# EAGLE design untitled (EAGLE 9.6.2)
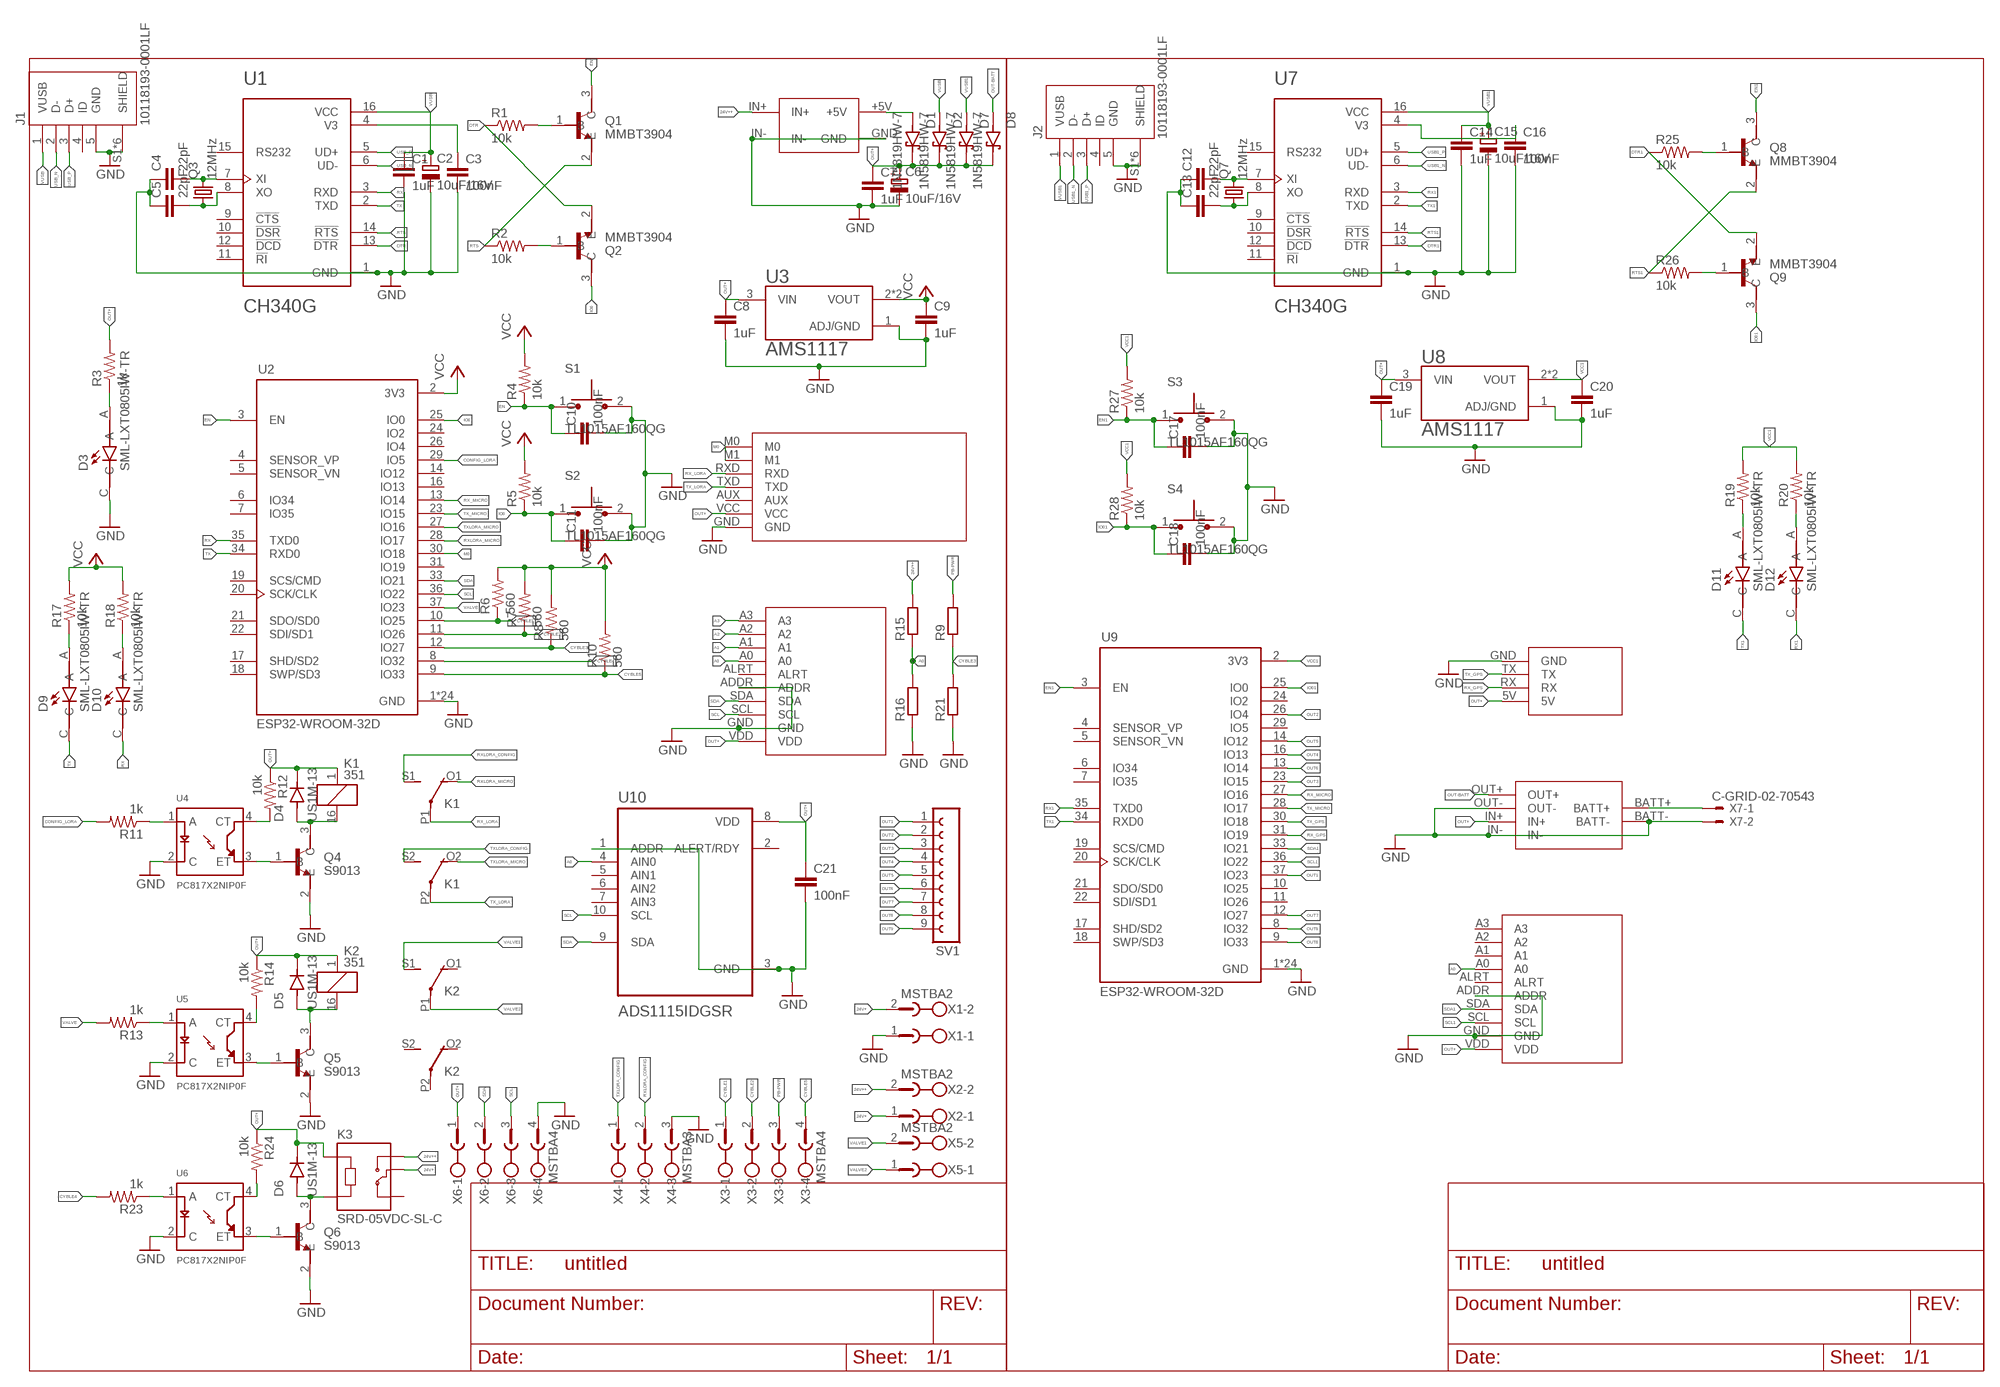
[diagram p0: schematic, sheet 1]

## Parts
ADS1  ADS1115  [ADS1115]
ADS2  ADS1115  [ADS1115]
C1  1uF  C-EUC0805K  [C0805K]
C2  10uF/16V  CPOL-EU153CLV-0505  [153CLV-0505]
C3  100nF  C-EUC0805K  [C0805K]
C4  22pF  C-EUC0805K  [C0805K]
C5  22pF  C-EUC0805K  [C0805K]
C6  10uF/16V  CPOL-EU153CLV-0505  [153CLV-0505]
C7  1uF  C-EUC0805K  [C0805K]
C8  1uF  C-EUC0805K  [C0805K]
C9  1uF  C-EUC0805K  [C0805K]
C10  100nF  C-EUC0805K  [C0805K]
C11  100nF  C-EUC0805K  [C0805K]
C12  22pF  C-EUC0805K  [C0805K]
C13  22pF  C-EUC0805K  [C0805K]
C14  1uF  C-EUC0805K  [C0805K]
C15  10uF/16V  CPOL-EU153CLV-0505  [153CLV-0505]
C16  100nF  C-EUC0805K  [C0805K]
C17  100nF  C-EUC0805K  [C0805K]
C18  100nF  C-EUC0805K  [C0805K]
C19  1uF  C-EUC0805K  [C0805K]
C20  1uF  C-EUC0805K  [C0805K]
C21  100nF  C-EUC0805K  [C0805K]
D1  1N5819HW-7  [SOD3715X145N]
D2  1N5819HW-7  [SOD3715X145N]
D3  SML-LXT0805IW-TR  [LEDC2012X120N]
D4  US1M-13  [DIOM5226X240N]
D5  US1M-13  [DIOM5226X240N]
D6  US1M-13  [DIOM5226X240N]
D7  1N5819HW-7  [SOD3715X145N]
D8  1N5819HW-7  [SOD3715X145N]
D9  SML-LXT0805IW-TR  [LEDC2012X120N]
D10  SML-LXT0805IW-TR  [LEDC2012X120N]
D11  SML-LXT0805IW-TR  [LEDC2012X120N]
D12  SML-LXT0805IW-TR  [LEDC2012X120N]
EBYTEE220-900T22D1  EBYTEE220-900T22D  [EBYTEE220-900T22D]
J1  10118193-0001LF  [FCI_10118193-0001LF]
J2  10118193-0001LF  [FCI_10118193-0001LF]
K1  351  [351]
K2  351  [351]
K3  SRD-05VDC-SL-C  [RELAY_SRD-05VDC-SL-C]
MODUL-BATT1  MODUL-BATT  [MODUL-BATT]
NEO-6MGPS1  NEO-6MGPS  [NEO-6MGPS]
Q1  MMBT3904  [SOT95P240X120-3N]
Q2  MMBT3904  [SOT95P240X120-3N]
Q3  12MHz  CRYSTALSM49  [SM49]
Q4  S9013  [SOT95P240X120-3N]
Q5  S9013  [SOT95P240X120-3N]
Q6  S9013  [SOT95P240X120-3N]
Q7  12MHz  CRYSTALSM49  [SM49]
Q8  MMBT3904  [SOT95P240X120-3N]
Q9  MMBT3904  [SOT95P240X120-3N]
R1  10k  R-US_M0805  [M0805]
R2  10k  R-US_M0805  [M0805]
R3  1k  R-US_M0805  [M0805]
R4  10k  R-US_M0805  [M0805]
R5  10k  R-US_M0805  [M0805]
R6  560  R-US_M0805  [M0805]
R7  560  R-US_M0805  [M0805]
R8  560  R-US_M0805  [M0805]
R9  R-EU_0207/12  [0207/12]
R10  560  R-US_M0805  [M0805]
R11  1k  R-US_M0805  [M0805]
R12  10k  R-US_M0805  [M0805]
R13  1k  R-US_M0805  [M0805]
R14  10k  R-US_M0805  [M0805]
R15  R-EU_0207/12  [0207/12]
R16  R-EU_0207/12  [0207/12]
R17  10k  R-US_M0805  [M0805]
R18  10k  R-US_M0805  [M0805]
R19  10k  R-US_M0805  [M0805]
R20  10k  R-US_M0805  [M0805]
R21  R-EU_0207/12  [0207/12]
R23  1k  R-US_M0805  [M0805]
R24  10k  R-US_M0805  [M0805]
R25  10k  R-US_M0805  [M0805]
R26  10k  R-US_M0805  [M0805]
R27  10k  R-US_M0805  [M0805]
R28  10k  R-US_M0805  [M0805]
S1  TL1015AF160QG  [SW_TL1015AF160QG]
S2  TL1015AF160QG  [SW_TL1015AF160QG]
S3  TL1015AF160QG  [SW_TL1015AF160QG]
S4  TL1015AF160QG  [SW_TL1015AF160QG]
SUPER-STEPDOWN1  SUPER-STEPDOWN  [SUPER-STEPDOWN]
SV1  FE09-1  [FE09]
U1  CH340G  [SOIC127P600X180-16N]
U2  ESP32-WROOM-32D  [MODULE_ESP32-WROOM-32D]
U3  AMS1117  [SOT229P700X180-4N]
U4  PC817X2NIP0F  [SOT254P975X400-4N]
U5  PC817X2NIP0F  [SOT254P975X400-4N]
U6  PC817X2NIP0F  [SOT254P975X400-4N]
U7  CH340G  [SOIC127P600X180-16N]
U8  AMS1117  [SOT229P700X180-4N]
U9  ESP32-WROOM-32D  [MODULE_ESP32-WROOM-32D]
U10  ADS1115IDGSR  [SOP50P490X110-10N]
X1  MSTBA2  [MSTBA2]
X2  MSTBA2  [MSTBA2]
X3  MSTBA4  [MSTBA4]
X4  MSTBA3  [MSTBA3]
X5  MSTBA2  [MSTBA2]
X6  MSTBA4  [MSTBA4]
X7  C-GRID-02-70543  [70543-02]

## Nets
24V+: K3.COM X1.2 X2.1
24V++: K3.NO R15.2 SUPER-STEPDOWN1.IN+ X2.2
A0: ADS1.A0 ADS2.A0 R15.1 R16.2 U10.4(AIN0)
A1: ADS1.A1
A2: ADS1.A2
A3: ADS1.A3
CONFIG_LORA: R11.2 U2.29(IO5)
CYBLE1: R6.1 U2.10(IO25) X3.1
CYBLE2: R7.1 U2.11(IO26) X3.2
CYBLE3: R8.1 R9.1 R21.2 U2.12(IO27)
CYBLE4: R23.2 U2.8(IO32)
CYBLE5: R10.1 U2.9(IO33) X3.4
DTR: Q2.2(E) R1.1 U1.13(!DTR)
DTR1: Q9.2(E) R25.1 U7.13(!DTR)
EN: C10.1 Q1.3(C) R4.1 S1.1 U2.3(EN)
EN1: C17.1 Q8.3(C) R27.1 S3.1 U9.3(EN)
GND: ADS1.ADDR ADS1.GND ADS2.ADDR ADS2.GND C1.2 C2.- C3.2 C4.1 C5.1 C6.- C7.2 C8.2 C9.2 C10.2 C11.2 C12.1 C13.1 C14.2 C15.- C16.2 C17.2 C18.2 C19.2 C20.2 C21.2 D3.C EBYTEE220-900T22D1.GND J1.5(GND) J1.S1(SHIELD) J1.S2(SHIELD) J1.S3(SHIELD) J1.S4(SHIELD) J1.S5(SHIELD) J1.S6(SHIELD) J2.5(GND) J2.S1(SHIELD) J2.S2(SHIELD) J2.S3(SHIELD) J2.S4(SHIELD) J2.S5(SHIELD) J2.S6(SHIELD) MODUL-BATT1.BATT- MODUL-BATT1.IN- MODUL-BATT1.OUT- NEO-6MGPS1.GND Q4.2(E) Q5.2(E) Q6.2(E) R16.1 R21.1 S1.2 S2.2 S3.2 S4.2 SUPER-STEPDOWN1.GND SUPER-STEPDOWN1.IN- U1.1(GND) U2.1(GND) U2.15(GND) U2.38(GND) U2.39_1(GND) U2.39_2(GND) U2.39_3(GND) U2.39_4(GND) U2.39_5(GND) U2.39_6(GND) U2.39_7(GND) U2.39_8(GND) U2.39_9(GND) U2.39_10(GND) U2.39_11(GND) U2.39_12(GND) U2.39_13(GND) U2.39_14(GND) U2.39_15(GND) U2.39_16(GND) U2.39_17(GND) U2.39_18(GND) U2.39_19(GND) U2.39_20(GND) U2.39_21(GND) U3.1(ADJ/GND) U4.2(C) U5.2(C) U6.2(C) U7.1(GND) U8.1(ADJ/GND) U9.1(GND) U9.15(GND) U9.38(GND) U9.39_1(GND) U9.39_2(GND) U9.39_3(GND) U9.39_4(GND) U9.39_5(GND) U9.39_6(GND) U9.39_7(GND) U9.39_8(GND) U9.39_9(GND) U9.39_10(GND) U9.39_11(GND) U9.39_12(GND) U9.39_13(GND) U9.39_14(GND) U9.39_15(GND) U9.39_16(GND) U9.39_17(GND) U9.39_18(GND) U9.39_19(GND) U9.39_20(GND) U9.39_21(GND) U10.1(ADDR) U10.3(GND) X1.1 X4.3 X6.4 X7.2
IO0: C11.1 Q2.3(C) R5.1 S2.1 U2.25(IO0)
IO01: C18.1 Q9.3(C) R28.1 S4.1 U9.25(IO0)
M0: EBYTEE220-900T22D1.M0 EBYTEE220-900T22D1.M1 U2.30(IO18)
N$1: C4.2 Q3.2 U1.7(XI)
N$2: C5.2 Q3.1 U1.8(XO)
N$3: Q1.1(B) R1.2
N$4: Q8.1(B) R25.2
N$5: C3.1 U1.4(V3)
N$6: D3.A R3.1
N$7: D1.A SUPER-STEPDOWN1.+5V
N$8: Q2.1(B) R2.2
N$9: R11.1 U4.1(A)
N$10: R12.2 U4.4(CT)
N$11: R13.1 U5.1(A)
N$12: D4.A K1.16 Q4.3(C)
N$13: Q4.1(B) U4.3(ET)
N$14: R14.2 U5.4(CT)
N$15: D5.A K2.16 Q5.3(C)
N$16: Q9.1(B) R26.2
N$17: Q5.1(B) U5.3(ET)
N$18: D9.A R17.1
N$19: R24.2 U6.4(CT)
N$20: D6.A K3.A2 Q6.3(C)
N$21: D10.A R18.1
N$22: D11.A R19.1
N$23: D12.A R20.1
N$24: Q6.1(B) U6.3(ET)
N$25: R23.1 U6.1(A)
N$26: C16.1 U7.4(V3)
N$27: C13.2 Q7.1 U7.8(XO)
N$28: C12.2 Q7.2 U7.7(XI)
N$29: MODUL-BATT1.BATT+ X7.1
OUT1: SV1.1 U9.37(IO23)
OUT2: SV1.2 U9.26(IO4)
OUT3: SV1.3 U9.23(IO15)
OUT4: SV1.4 U9.16(IO13)
OUT5: SV1.5 U9.14(IO12)
OUT6: SV1.6 U9.13(IO14)
OUT7: SV1.7 U9.12(IO27)
OUT8: SV1.8 U9.9(IO33)
OUT9: SV1.9 U9.8(IO32)
OUT+: ADS1.VDD ADS2.VDD C6.+ C7.1 C8.1 C19.1 C21.1 D1.C(K) D2.C(K) D4.C(K) D5.C(K) D6.C(K) D7.C(K) D8.C(K) EBYTEE220-900T22D1.VCC K1.1 K2.1 K3.A1 MODUL-BATT1.IN+ NEO-6MGPS1.5V R3.2 R12.1 R14.1 R24.1 U3.3(VIN) U8.3(VIN) U10.8(VDD) X6.1
OUT-BATT: D8.A MODUL-BATT1.OUT+
PB-PWR: R9.2 X3.3
RTS: Q1.2(E) R2.1 U1.14(!RTS)
RTS1: Q8.2(E) R26.1 U7.14(!RTS)
RX: D10.C U1.3(RXD) U2.35(TXD0)
RX1: D12.C U7.3(RXD) U9.35(TXD0)
RX_GPS: NEO-6MGPS1.RX U9.31(IO19)
RX_LORA: EBYTEE220-900T22D1.RXD K1.P1(2:P)
RX_MICRO: U2.13(IO14) U9.27(IO16)
RXLORA_CONFIG: K1.S1(2:S) X4.2
RXLORA_MICRO: K1.O1(2:O) U2.28(IO17)
SCL: ADS1.SCL U2.36(IO22) U10.10(SCL) X6.3
SCL1: ADS2.SCL U9.36(IO22)
SDA: ADS1.SDA U2.33(IO21) U10.9(SDA) X6.2
SDA1: ADS2.SDA U9.33(IO21)
TX: D9.C U1.2(TXD) U2.34(RXD0)
TX1: D11.C U7.2(TXD) U9.34(RXD0)
TX_GPS: NEO-6MGPS1.TX U9.30(IO18)
TX_LORA: EBYTEE220-900T22D1.TXD K1.P2(3:P)
TX_MICRO: U2.23(IO15) U9.28(IO17)
TXLORA_CONFIG: K1.S2(3:S) X4.1
TXLORA_MICRO: K1.O2(3:O) U2.27(IO16)
USB1_N: J2.2(D-) U7.6(UD-)
USB1_P: J2.3(D+) U7.5(UD+)
USB_N: J1.2(D-) U1.6(UD-)
USB_P: J1.3(D+) U1.5(UD+)
VALVE: R13.2 U2.37(IO23)
VALVE1: K2.S1(2:S) X5.2
VALVE2: K2.P1(2:P) X5.1
VCC: C9.1 R4.2 R5.2 R6.2 R7.2 R8.2 R10.2 R17.2 R18.2 U2.2(3V3) U3.2(VOUT) U3.4(VOUT)
VCC1: C20.1 R19.2 R20.2 R27.2 R28.2 U8.2(VOUT) U8.4(VOUT) U9.2(3V3)
VUSB: C1.1 C2.+ D2.A J1.1(VUSB) U1.16(VCC)
VUSB1: C14.1 C15.+ D7.A J2.1(VUSB) U7.16(VCC)
Unconnected: ADS1.ALRT ADS2.A1 ADS2.A2 ADS2.A3 ADS2.ALRT EBYTEE220-900T22D1.AUX J1.4(ID) J2.4(ID) K2.O1(2:O) K2.O2(3:O) K2.P2(3:P) K2.S2(3:S) K3.NC U1.9(!CTS) U1.10(!DSR) U1.11(!RI) U1.12(!DCD) U1.15(RS232) U2.4(SENSOR_VP) U2.5(SENSOR_VN) U2.6(IO34) U2.7(IO35) U2.14(IO12) U2.16(IO13) U2.17(SHD/SD2) U2.18(SWP/SD3) U2.19(SCS/CMD) U2.20(SCK/CLK) U2.21(SDO/SD0) U2.22(SDI/SD1) U2.24(IO2) U2.26(IO4) U2.31(IO19) U7.9(!CTS) U7.10(!DSR) U7.11(!RI) U7.12(!DCD) U7.15(RS232) U9.4(SENSOR_VP) U9.5(SENSOR_VN) U9.6(IO34) U9.7(IO35) U9.10(IO25) U9.11(IO26) U9.17(SHD/SD2) U9.18(SWP/SD3) U9.19(SCS/CMD) U9.20(SCK/CLK) U9.21(SDO/SD0) U9.22(SDI/SD1) U9.24(IO2) U9.29(IO5) U10.2(ALERT/RDY) U10.5(AIN1) U10.6(AIN2) U10.7(AIN3)

## Library data of the parts
ADS1 ADS2 = ds1115:ADS1115
C1 C3-C5 C7-C14 C16-C21 = rcl:C-EU: CAPACITOR, European symbol; SPICEPREFIX: C
C2 C6 C15 = rcl:CPOL-EU: POLARIZED CAPACITOR, European symbol; SPICEPREFIX: C
D1 D2 D7 D8 = 1N5819HW-7:1N5819HW-7: 1N5819HW Series 40 V 1 A Surface Mount Schottky Barrier Rectifier - SOD-123 Check availability <https://pricing.snapeda.com/parts/1N5819HW-7/Diodes%20Inc./view-part?ref=eda>; AVAILABILITY: In Stock; DESCRIPTION: Diode Schottky 40 V 1A Surface Mount SOD-123; MF: Diodes Inc.; MP: 1N5819HW-7; PACKAGE: SOD-123 Fairchild Semiconductor; PRICE: None; PURCHASE-URL: https://pricing.snapeda.com/search/part/1N5819HW-7/?ref=eda
D3 D9-D12 = SML-LXT0805IW-TR:SML-LXT0805IW-TR: LED; Luminous Intensity:11µcd; Viewing Angle:140°; Forward Current:30mA; Forward Voltage:2V; Color:Red; LED Color:Red; Leaded Process Compatible:Yes; Lens Color:White; Mounting Type:Surface Mount ;RoHS Compliant: Yes Check availability <https://pricing.snapeda.com/parts/SML-LXT0805IW-TR/Lumex%20Opto/Components/view-part?ref=eda>; AVAILABILITY: In Stock; DESCRIPTION: Red - LED Indication - Discrete 2V 0805 (2012 Metric); MF: Lumex Opto/Components; MP: SML-LXT0805IW-TR; PACKAGE: 0805 Lumex; PRICE: None; PURCHASE-URL: https://pricing.snapeda.com/search/part/SML-LXT0805IW-TR/?ref=eda
D4-D6 = US1M-13:US1M-13: Diode, Fast Recovery, 1a, 1kv, Do-214ac-2, Full Reel Check availability <https://pricing.snapeda.com/parts/US1M-13/Diodes%20Incorporated/view-part?ref=eda>; AVAILABILITY: In Stock; DESCRIPTION: Diode Standard 1000 V 1A Surface Mount SMA; MF: Diodes Incorporated; MP: US1M-13; PACKAGE: DO-214AC-214 Diodes Incorporated; PRICE: None; PURCHASE-URL: https://pricing.snapeda.com/search/part/US1M-13/?ref=eda
EBYTEE220-900T22D1 = EByte E220-900T22D:EBYTEE220-900T22D
J1 J2 = 10118193-0001LF:10118193-0001LF: Micro USB B Type Receptacle Check availability <https://pricing.snapeda.com/parts/10118193-0001LF/FCI/view-part?ref=eda>; AVAILABILITY: In Stock; DESCRIPTION: USB - micro B USB 2.0 Receptacle Connector 5 Position Surface Mount, Right Angle; Through Hole; MF: FCI; MP: 10118193-0001LF; PACKAGE: None; PRICE: None; PURCHASE-URL: https://pricing.snapeda.com/search/part/10118193-0001LF/?ref=eda
K1 K2 = relay:351: RELAY 2 x switch, Omron; OC_FARNELL: unknown; OC_NEWARK: unknown
K3 = SRD-05VDC-SL-C:SRD-05VDC-SL-C: 5V Trigger Relay Module For Arduino And Raspberry Pi 5V Trigger Relay Module For Arduino And Raspberry Pi Check availability <https://pricing.snapeda.com/parts/SRD-05VDC-SL-C/Songle%20Relay/view-part?ref=eda>; AVAILABILITY: Not in stock; DESCRIPTION: 5V Trigger Relay Module For Arduino And Raspberry Pi 5V Trigger Relay Module For Arduino And Raspberry Pi; MF: Songle Relay; MP: SRD-05VDC-SL-C; PACKAGE: NON STANDARD-5 Songle Relay; PRICE: None
MODUL-BATT1 = MODUL-BATT:MODUL-BATT
NEO-6MGPS1 = NEO-6M GPS:NEO-6MGPS
Q1 Q2 Q8 Q9 = MMBT3904:MMBT3904: MMBT3904 Series 40 V CE Breakdown 0.2 A NPN General Purpose Amplifier - SOT-23 Check availability <https://pricing.snapeda.com/parts/MMBT3904/ON%20Semiconductor/view-part?ref=eda>; AVAILABILITY: In Stock; DESCRIPTION: Bipolar (BJT) Transistor NPN 40 V 200 mA 300MHz 300 mW Surface Mount SOT-23-3 (TO-236); MF: ON Semiconductor; MP: MMBT3904; PACKAGE: SOT-23-3 Motorola; PRICE: None
Q3 Q7 = crystal:CRYSTAL: CRYSTAL; OC_FARNELL: unknown; OC_NEWARK: unknown
Q4-Q6 = S9013:S9013: SMD Transistors NPN 25V-500mA Check availability <https://pricing.snapeda.com/parts/S9013/JCET/view-part?ref=eda>; AVAILABILITY: In Stock; DESCRIPTION: Bipolar (BJT) Transistor NPN 20V 500mA 625mW Through Hole TO-92-3; MF: JCET; MP: S9013; PACKAGE: SOT-23-3 JCET; PRICE: None; PURCHASE-URL: https://pricing.snapeda.com/search/part/S9013/?ref=eda
R1-R8 R10-R14 R17-R20 R23-R28 = rcl:R-US_: RESISTOR, American symbol; SPICEPREFIX: R
R9 R15 R16 R21 = rcl:R-EU_: RESISTOR, European symbol; SPICEPREFIX: R
S1-S4 = TL1015AF160QG:TL1015AF160QG: Tactile Switch SPST-NO Top Actuated Surface Mount Check availability <https://pricing.snapeda.com/parts/TL1015AF160QG/E-Switch/view-part?ref=eda>; AVAILABILITY: In Stock; DESCRIPTION: Tactile Switch SPST-NO Top Actuated Surface Mount; MF: E-Switch; MP: TL1015AF160QG; PACKAGE: None; PRICE: None; PURCHASE-URL: https://pricing.snapeda.com/search/part/TL1015AF160QG/?ref=eda
SUPER-STEPDOWN1 = SUPER-STEPDOWN:SUPER-STEPDOWN
SV1 = con-lsta:FE09-1: FEMALE HEADER; OC_FARNELL: unknown; OC_NEWARK: unknown
U1 U7 = CH340G:CH340G: Check availability <https://pricing.snapeda.com/parts/Ch340G/WCH/view-part?ref=eda>; AVAILABILITY: Not in stock; DESCRIPTION: USB Interface Integrated Circuit; MF: WCH; MP: Ch340G; PACKAGE: None; PRICE: None
U2 U9 = ESP32-WROOM-32D:ESP32-WROOM-32D: Bluetooth, WiFi 802.11b/g/n, Bluetooth v4.2 + EDR, Class 1, 2 and 3 Transceiver Module 2.4GHz ~ 2.5GHz Integrated, Trace Surface Mount Check availability <https://pricing.snapeda.com/parts/ESP32-WROOM-32D/Espressif%20Systems/view-part?ref=eda>; AVAILABILITY: In Stock; DESCRIPTION: Bluetooth, WiFi 802.11b/g/n, Bluetooth v4.2 +EDR, Class 1, 2 and 3 Transceiver Module 2.4GHz ~ 2.5GHz Integrated; MF: Espressif Systems; MP: ESP32-WROOM-32D; PACKAGE: Module Espressif Systems; PRICE: None; PURCHASE-URL: https://pricing.snapeda.com/search/part/ESP32-WROOM-32D/?ref=eda
U3 U8 = AMS1117:AMS1117: Sot223/Pkg 1-Amp 5-Volt Low Drop Out Voltage Regulatator Check availability <https://pricing.snapeda.com/parts/AMS1117/Advanced%20Monolithic%20Systems/view-part?ref=eda>; AVAILABILITY: Not in stock; DESCRIPTION: 1A LOW DROPOUT VOLTAGE REGULATOR SOT-223; MF: Advanced Monolithic Systems; MP: AMS1117; PACKAGE: SOT-223 Seeed Technology; PRICE: None
U4-U6 = PC817X2NIP0F:PC817X2NIP0F: PC817 Series 1 Channel 80 V 5000 Vrms General Purpose Photocoupler - DIP-4 Check availability <https://pricing.snapeda.com/parts/PC817X2NIP0F/Sharp%20Microelectronics/view-part?ref=eda>; AVAILABILITY: Not in stock; DESCRIPTION: Optoisolator Transistor Output 5000Vrms 1 Channel 4-SMD; MF: Sharp Microelectronics; MP: PC817X2NIP0F; PACKAGE: SMD-4 Sharp Microelectronics; PRICE: None
U10 = ADS1115IDGSR:ADS1115IDGSR: Check availability <https://pricing.snapeda.com/parts/ADS1115IDGSR/Texas%20Instruments/view-part?ref=eda>; AVAILABILITY: In Stock; DESCRIPTION: 16-bit, 860-SPS, 4-channel, delta-sigma ADC with PGA, oscillator, VREF, comparator and I2C; MF: Texas Instruments; MP: ADS1115IDGSR; PACKAGE: VSSOP-10 Texas Instruments; PRICE: None; PURCHASE-URL: https://pricing.snapeda.com/search/part/ADS1115IDGSR/?ref=eda
X1 X2 X5 = con-phoenix-508:MSTBA2: PHOENIX; MF: FARNELL; MPN: 1757242; OC_FARNELL: 3705171; OC_NEWARK: 71C4161
X3 X6 = con-phoenix-508:MSTBA4: PHOENIX; MF: FARNELL; MPN: 1757268; OC_FARNELL: 3705195; OC_NEWARK: 71C4163
X4 = con-phoenix-508:MSTBA3: PHOENIX; MF: FARNELL; MPN: 1757255; OC_FARNELL: 3705183; OC_NEWARK: 71C4162
X7 = con-molex:C-GRID-02: CONNECTOR wire to board 2.54 mm (0.100") pitch header; MF: MOLEX; OC_FARNELL: unknown; OC_NEWARK: unknown

## Board
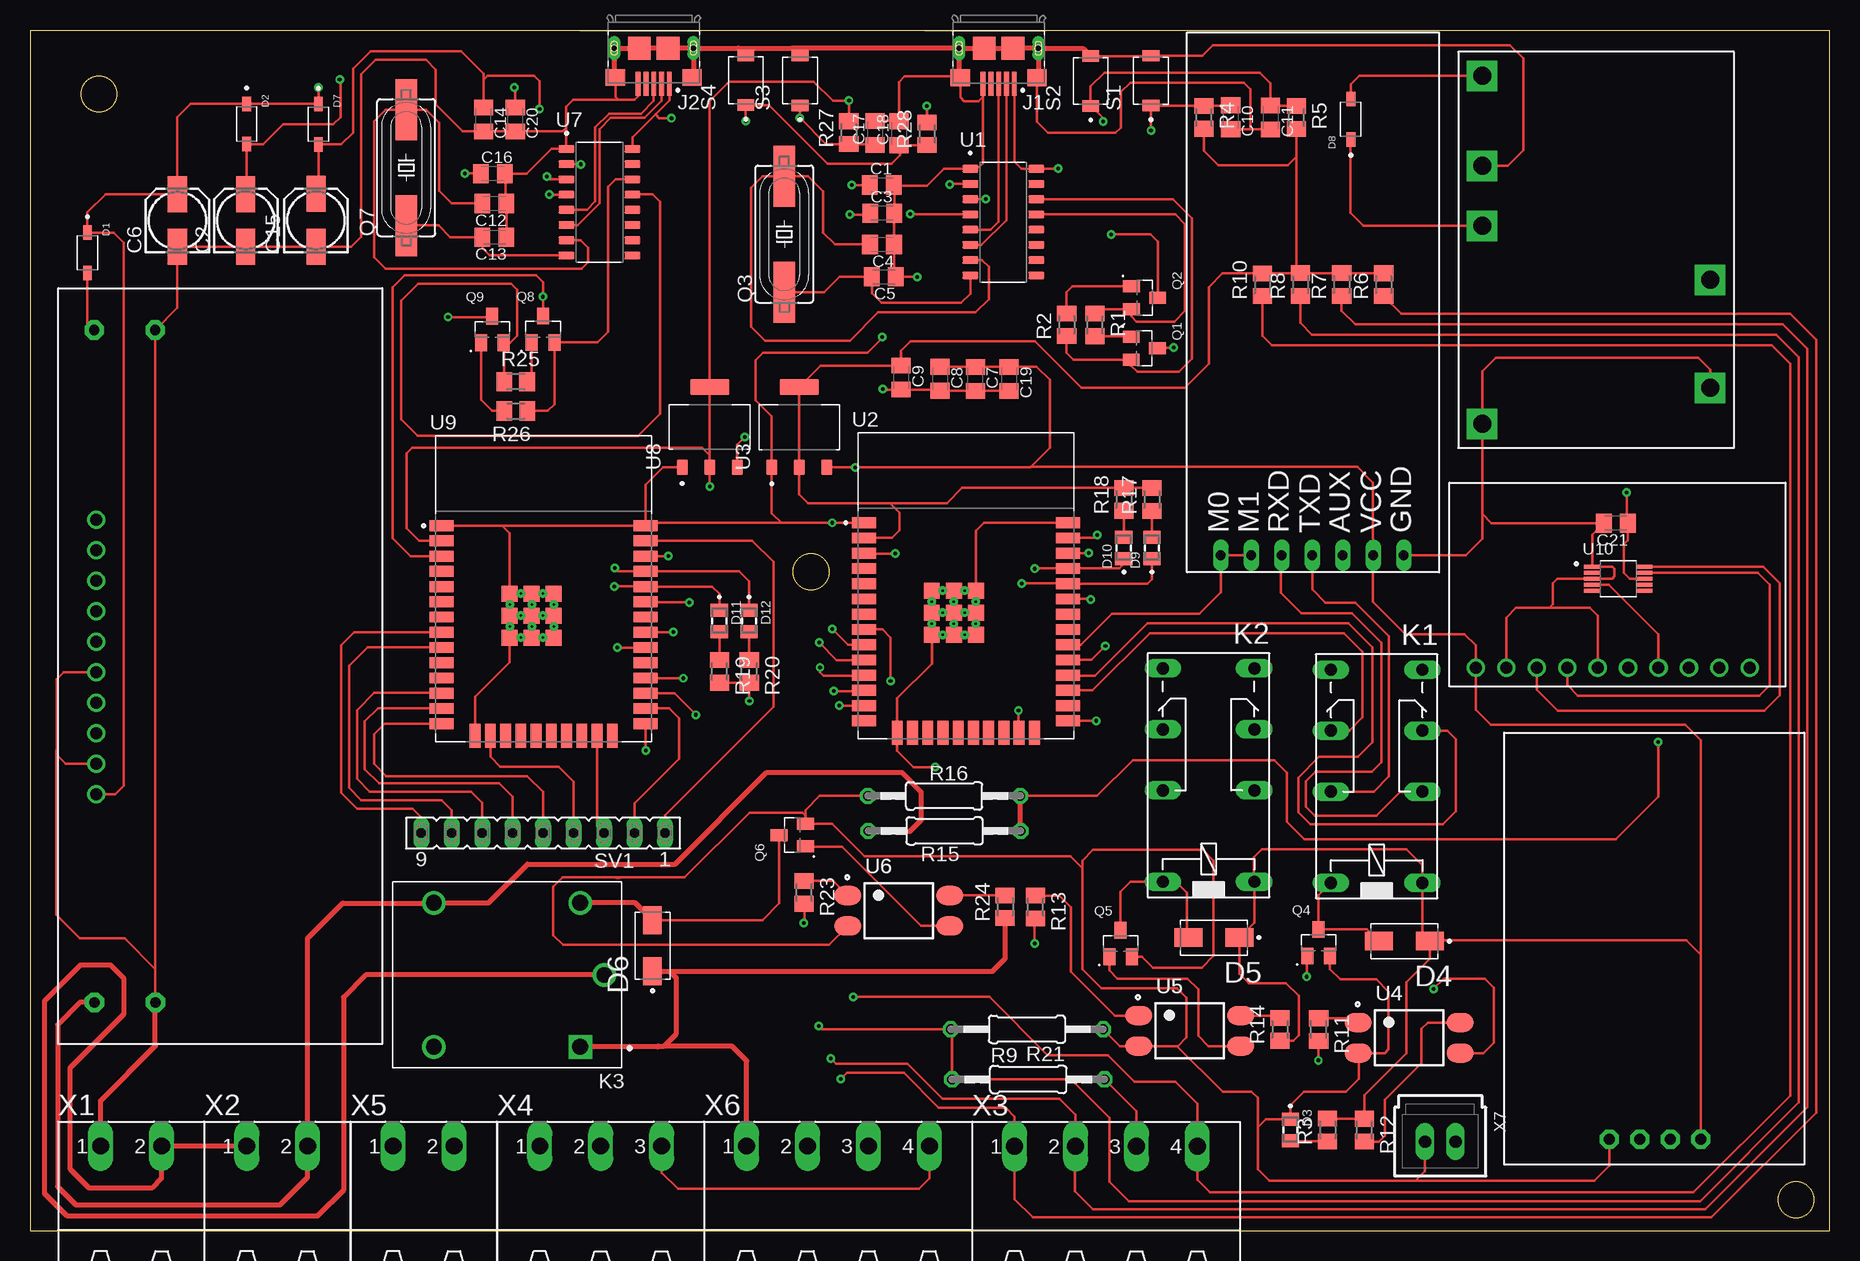
[diagram p1: board, top side]
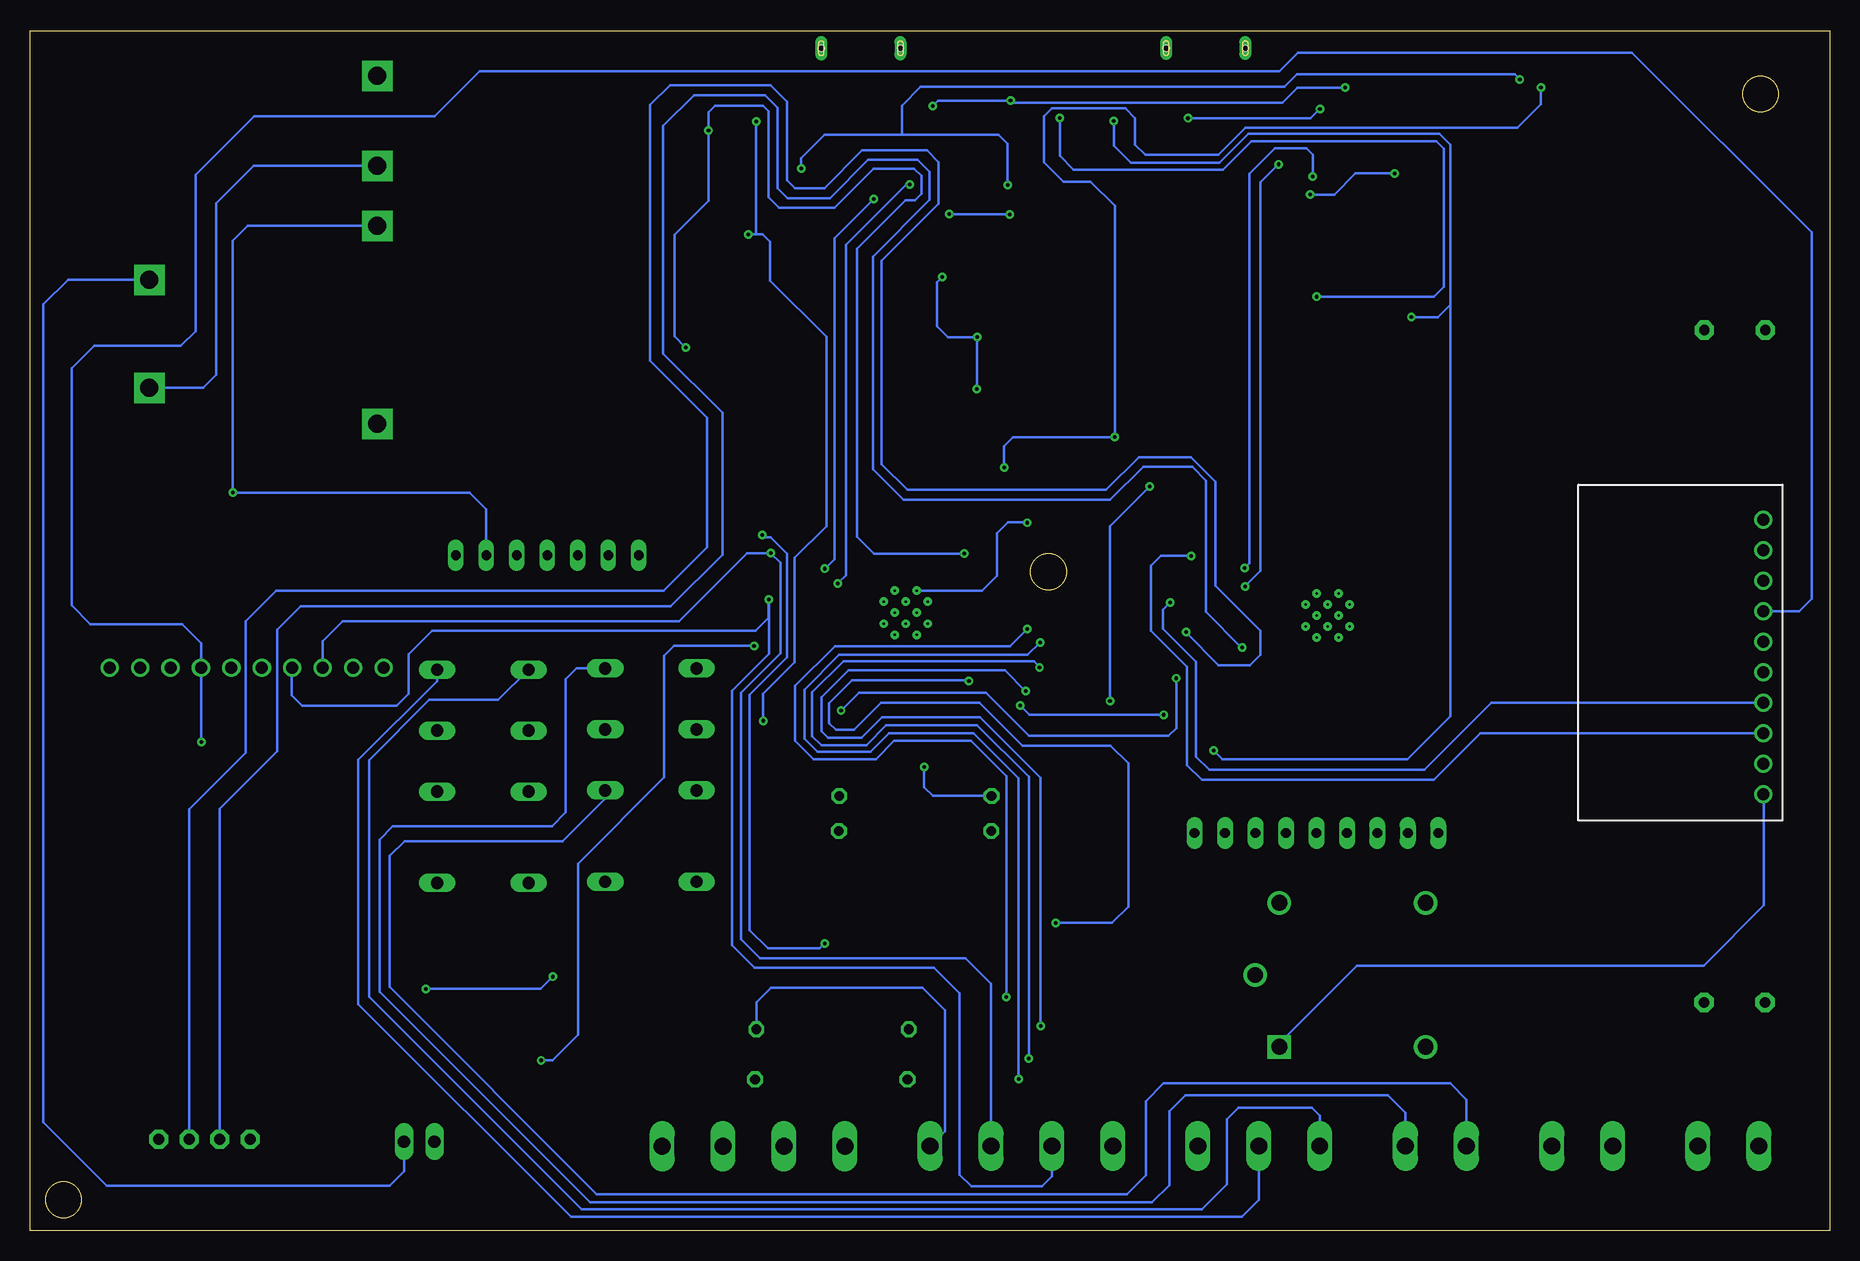
[diagram p2: board, bottom side, seen from below]

Size 150 x 100 mm. Coordinates in mm from the lower left corner, seen from the top.
Outline: 0,0 150,0 150,100 0,100 0,0
Outline: circle at 5.75,94.74 radius 1.5
Outline: circle at 147.21,2.59 radius 1.5
Outline: circle at 65.09,54.92 radius 1.5
Copper layers (1*16): Top 0.035mm / dielectric 1.5mm / Bottom 0.035mm
Design rules "default *": minimum track width 6mil, minimum drill 0.3mm, track to track 6mil, track to pad 6mil, pad to pad 6mil, via to via 6mil, smd to smd 6mil, copper to edge 40mil, drill to drill 40mil, minimum pad ring 10mil, minimum via ring 8mil, stop-mask expansion 4mil, vias tented up to drill 0mil, thermal gap 10mil

### Footprints (pad centres in the part's own frame; a part is rotated, then mirrored left to right if it is on the bottom)
ADS1115 = drill 1: A0 -6.35,-1.27; A1 -6.35,-3.81; A2 -6.35,-6.35; A3 -6.35,-8.89; ADDR -6.35,3.81; ALRT -6.35,1.27; GND -6.35,11.43; SCL -6.35,8.89; SDA -6.35,6.35; VDD -6.35,13.97
C0805K = smd 1.3 x 1.6: 1 -1,0; 2 1,0
153CLV-0505 = smd 3 x 1.6: + 2.2,0; - -2.2,0
SOD3715X145N = smd 1.21 x 0.73: A 1.68,0; C -1.68,0
LEDC2012X120N = smd 1.1 x 1.45: A 0.9,0; C -0.9,0
DIOM5226X240N = smd 2.33 x 1.55: A 2.135,0; C -2.135,0
EBYTEE220-900T22D = drill 0.8 pad 1.27 long: AUX -4.56,-10.98; GND -4.56,-16.06; M0 -4.56,-0.82; M1 -4.56,-3.36; RXD -4.56,-5.9; TXD -4.56,-8.44; VCC -4.56,-13.52
FCI_10118193-0001LF = smd 0.4 x 2: 1 -1.3,2.975; 2 -0.65,2.975; 3 0,2.975; 4 0.65,2.975; 5 1.3,2.975 | smd 1.6 x 1.4: S1 -3.2,2.45; S2 3.2,2.45 | smd 1.9 x 1.9: S3 1.2,0; S4 -1.2,0 | drill 0.5 pad 0.9 long: S5 -3.3,0; S6 3.3,0 | hole 0.5: -3.3,0; 3.3,0
351 = drill 1.016 long: 1 -3.81,-3.81; 16 -3.81,3.81; O1 8.89,-3.81; O2 8.89,3.81; P1 3.81,-3.81; P2 3.81,3.81; S1 13.97,-3.81; S2 13.97,3.81
RELAY_SRD-05VDC-SL-C = drill 1.32 square: A1 -6.1,6 | drill 1.32: A2 -6.1,-6; NC 6.1,6; NO 6.1,-6 | drill 1.29: COM -8.1,0
MODUL-BATT = drill 1.5 pad 2.54 square: BATT+ 14,2; BATT- 5,2; IN+ 18.5,21; IN- 2,21; OUT+ 31,21; OUT- 23.5,21
NEO-6MGPS = drill 0.9 pad 1.6 octagon: 5V -8.89,7.62; GND -8.89,15.24; RX -8.89,10.16; TX -8.89,12.7
SOT95P240X120-3N = smd 1 x 1.4: 1 -0.95,-1.1; 2 0.95,-1.1; 3 0,1.1
SM49 = smd 5.08 x 1.778: 1 -4.826,0; 2 4.826,0
M0805 = smd 1.3 x 1.6: 1 -0.95,0; 2 0.95,0
0207/12 = drill 0.813 octagon: 1 -6.35,0; 2 6.35,0
SW_TL1015AF160QG = smd 0.95 x 1.4: 1 -2.075,0; 2 2.075,0
SUPER-STEPDOWN = drill 0.85 pad 1.6 octagon: +5V 59.509,24.006; GND 59.509,18.926; IN+ 3.478,23.979; IN- 3.478,18.899
FE09 = drill 0.813 long: 1 -10.16,0; 2 -7.62,0; 3 -5.08,0; 4 -2.54,0; 5 0,0; 6 2.54,0; 7 5.08,0; 8 7.62,0; 9 10.16,0
SOIC127P600X180-16N = smd 1.31 x 0.62: 1 -2.75,4.445; 2 -2.75,3.175; 3 -2.75,1.905; 4 -2.75,0.635; 5 -2.75,-0.635; 6 -2.75,-1.905; 7 -2.75,-3.175; 8 -2.75,-4.445; 9 2.75,-4.445; 10 2.75,-3.175; 11 2.75,-1.905; 12 2.75,-0.635; 13 2.75,0.635; 14 2.75,1.905; 15 2.75,3.175; 16 2.75,4.445
MODULE_ESP32-WROOM-32D = smd 2 x 0.9: 1 -8.5,5.26; 2 -8.5,3.99; 3 -8.5,2.72; 4 -8.5,1.45; 5 -8.5,0.18; 6 -8.5,-1.09; 7 -8.5,-2.36; 8 -8.5,-3.63; 9 -8.5,-4.9; 10 -8.5,-6.17; 11 -8.5,-7.44; 12 -8.5,-8.71; 13 -8.5,-9.98; 14 -8.5,-11.25; 25 8.5,-11.25; 26 8.5,-9.98; 27 8.5,-8.71; 28 8.5,-7.44; 29 8.5,-6.17; 30 8.5,-4.9; 31 8.5,-3.63; 32 8.5,-2.36; 33 8.5,-1.09; 34 8.5,0.18; 35 8.5,1.45; 36 8.5,2.72; 37 8.5,3.99; 38 8.5,5.26 | smd 0.9 x 2: 15 -5.715,-12.25; 16 -4.445,-12.25; 17 -3.175,-12.25; 18 -1.905,-12.25; 19 -0.635,-12.25; 20 0.635,-12.25; 21 1.905,-12.25; 22 3.175,-12.25; 23 4.445,-12.25; 24 5.715,-12.25 | smd 1.33 x 1.33: 39_1 -2.835,-0.405; 39_2 -1,-0.405; 39_3 0.835,-0.405; 39_4 -2.835,-2.24; 39_5 -1,-2.24; 39_6 0.835,-2.24; 39_7 -2.835,-4.075; 39_8 -1,-4.075; 39_9 0.835,-4.075 | drill 0.2 pad 0.3: 39_10 -1.917,-0.405; 39_11 -0.083,-0.405; 39_12 -2.835,-1.323; 39_13 -1,-1.323; 39_14 0.835,-1.323; 39_15 -1.917,-2.24; 39_16 -0.083,-2.24; 39_17 -2.835,-3.158; 39_18 -1,-3.158; 39_19 0.835,-3.158; 39_20 -1.917,-4.075; 39_21 -0.083,-4.075
SOT229P700X180-4N = smd 1.31 x 0.93: 1 -3.345,2.29; 2 -3.345,0; 3 -3.345,-2.29 | smd 1.31 x 3.24: 4 3.345,0
SOT254P975X400-4N = smd 2.25 x 1.6: 1 -4.25,1.27; 2 -4.25,-1.27; 3 4.25,-1.27; 4 4.25,1.27
SOP50P490X110-10N = smd 1.47 x 0.28: 1 -2.15,1; 2 -2.15,0.5; 3 -2.15,0; 4 -2.15,-0.5; 5 -2.15,-1; 6 2.15,-1; 7 2.15,-0.5; 8 2.15,0; 9 2.15,0.5; 10 2.15,1
MSTBA2 = drill 1.397 long: 1 -2.54,5.08; 2 2.54,5.08
MSTBA4 = drill 1.397 long: 1 -7.62,5.08; 2 -2.54,5.08; 3 2.54,5.08; 4 7.62,5.08
MSTBA3 = drill 1.397 long: 1 -5.08,5.08; 2 0,5.08; 3 5.08,5.08
70543-02 = drill 1.016 long: 1 -1.27,0; 2 1.27,0

### Placement (x,y rotation side)
ADS1  134.48,53.28 90 top
ADS2  11.86,50.36 180 bottom
C1  71.01,87.16 0 top
C2  17.98,84.2 90 top
C3  71.05,84.81 0 top
C4  71.02,82.2 180 top
C5  71.17,79.51 180 top
C6  12.29,84.19 90 top
C7  78.81,71 270 top
C8  75.86,71.01 270 top
C9  72.62,71.12 270 top
C10  100.08,92.81 270 top
C11  103.4,92.78 270 top
C12  38.71,85.62 180 top
C13  38.72,82.81 180 top
C14  37.8,92.63 270 top
C15  23.84,84.21 90 top
C16  38.59,88.1 0 top
C17  70.44,91.51 90 top
C18  72.45,91.47 90 top
C19  81.62,71 270 top
C20  40.45,92.63 270 top
C21  132.19,58.98 180 top
D1  4.79,81.51 270 top
D2  18.06,92.24 270 top
D3  105.06,8.41 270 top
D4  114.56,24.15 180 top
D5  98.68,24.44 180 top
D6  51.89,23.77 90 top
D7  24.04,92.21 270 top
D8  110.1,92.65 90 top
D9  93.52,56.91 90 top
D10  91.18,56.91 90 top
D11  57.47,50.83 270 top
D12  59.93,50.83 270 top
EBYTEE220-900T22D1  98.45,60.87 90 top
J1  80.74,98.55 180 top
J2  52,98.56 180 top
K1  112.25,32.8 90 top
K2  98.24,32.9 90 top
K3  39.77,21.33 180 top
MODUL-BATT1  142.05,65.26 90 top
NEO-6MGPS1  146.88,16.52 90 top
Q1  92.89,73.54 270 top
Q2  92.9,77.76 270 top
Q3  62.88,83.07 90 top
Q4  107.41,24.01 0 top
Q5  90.91,23.94 0 top
Q6  63.55,32.99 90 top
Q7  31.37,88.6 90 top
Q8  42.76,75.14 0 top
Q9  38.54,75.12 0 top
R1  88.77,75.51 270 top
R2  86.41,75.51 90 top
R3  108.16,8.4 90 top
R4  97.85,92.79 270 top
R5  105.56,92.78 270 top
R6  112.83,78.86 90 top
R7  109.33,78.86 90 top
R8  105.89,78.86 90 top
R9  83.21,12.62 0 top
R10  102.73,78.85 90 top
R11  107.42,16.77 270 top
R12  111.22,8.39 270 top
R13  83.8,26.99 270 top
R14  104.18,16.8 90 top
R15  76.23,33.33 180 top
R16  76.2,36.25 0 top
R17  93.53,60.94 90 top
R18  91.2,60.96 90 top
R19  57.49,46.63 270 top
R20  59.96,46.62 270 top
R21  83.1,16.8 180 top
R23  64.53,28.22 270 top
R24  81.28,27.01 90 top
R25  40.49,70.77 0 top
R26  40.5,68.33 180 top
R27  68.25,91.52 90 top
R28  74.78,91.43 90 top
S1  93.43,95.85 90 top
S2  88.41,95.83 90 top
S3  64.19,95.86 90 top
S4  59.66,95.89 90 top
SUPER-STEPDOWN1  29.36,15.56 90 top
SV1  42.77,33.15 180 top
U1  81.13,84.07 0 top
U2  78,53.75 0 top
U3  64.12,66.98 90 top
U4  114.96,16.08 0 top
U5  96.66,16.67 0 top
U6  72.42,26.68 0 top
U7  47.47,85.73 0 top
U8  56.65,66.99 90 top
U9  42.82,53.51 0 top
U10  132.39,54.35 0 top
X1  8.43,2 0 top
X2  20.6,2 0 top
X3  89.69,1.97 0 top
X4  47.57,1.99 0 top
X5  32.81,1.99 0 top
X6  67.35,2 0 top
X7  117.56,7.44 180 top

### Tracks (layer width: path | path; a pad name or v marks a point on that pad's centre or on a via)
24V+
  Top 0.406: X2.1 X1.2 10.97,4.37 10.21,3.61 4.89,3.61 3.32,5.18 3.32,13.56 7.8,18.04 7.8,21.06 6.7,22.16 4.21,22.16 1.22,19.17 1.22,3.11 3.11,1.22 23.95,1.22 26.13,3.4 26.13,19.48 27.98,21.33 K3.COM
24V++
  Top 0.406: SUPER-STEPDOWN1.IN+ 4.15,19.04 2.3,17.19 2.3,3.69 3.82,2.17 20.84,2.17 23.14,4.47 X2.2 23.14,24.39 26.08,27.32 33.66,27.32 K3.NO 38.23,27.33 41.46,30.57 53.78,30.57 61.41,38.2 72.65,38.2 74.29,36.57 74.29,34.24 73.32,33.27 69.93,33.27 R15.2
A0  (via drill 0.3)
  Top 0.203: ADS1.A0 135.75,49.72 131.62,53.85 U10.4 | R16.2 88.96,36.25 91.92,39.21 103.72,39.21 104.76,38.16 104.76,34.1 106.22,32.65 132.18,32.65 135.72,36.2 v135.72,40.73
  Top 0.406: R15.1 82.58,36.22 R16.2
  Bottom 0.203: v135.72,40.73 135.72,46.9 | 135.72,46.9 ADS1.A0 | ADS2.A0 2.51,51.63 1.48,52.66 1.48,83.21 16.46,98.19 44.29,98.19 45.85,96.63 112.51,96.63 116.25,92.89 131.3,92.89 136.19,88.01 136.19,74.99 137.42,73.75 144.66,73.75 146.53,71.89 146.53,52.12 144.96,50.55 137.32,50.55 135.72,48.95 135.72,46.9
CONFIG_LORA  (via drill 0.3)
  Top 0.203: U2.29 88.47,47.58 v89.64,48.75 | v107.4,14.22 107.4,15.8 R11.2
  Bottom 0.203: v89.64,48.75 96.33,48.75 97.13,47.95 97.13,37.8 104.33,30.59 104.33,16.34 106.45,14.22 v107.4,14.22
CYBLE1  (via drill 0.3)
  Top 0.203: R6.1 114.32,76.42 146.72,76.42 148.88,74.25 148.88,9.85 140.16,1.12 83.58,1.12 82.06,2.64 82.06,7.04 X3.1 82.07,9.53 81.35,10.25 75.74,10.25 72.83,13.16 68.1,13.16 v67.59,12.66 | v65.8,49.03 65.8,49.02 67.25,47.57 U2.10
  Bottom 0.203: v67.59,12.66 67.59,37.74 71.34,41.49 78.39,41.49 79.95,39.93 84.33,39.93 85.44,41.03 85.44,45.11 82.56,47.99 66.84,47.99 65.81,49.03 v65.8,49.03
CYBLE2  (via drill 0.3)
  Top 0.203: R7.1 109.33,76.69 110.47,75.55 146.12,75.55 148.16,73.51 148.16,10.3 139.65,1.79 88.61,1.79 87.11,3.28 87.11,7.02 X3.2 87.15,9.67 85.82,11.01 76.05,11.01 73.14,13.92 67.2,13.92 v66.75,14.38 | v65.86,46.95 65.86,46.55 66.15,46.26 69.45,46.26 U2.11
  Bottom 0.203: v66.75,14.38 66.75,37.83 71.05,42.13 78.64,42.13 80.29,40.48 84.04,40.48 84.79,41.24 84.79,44.87 82.2,47.47 66.31,47.47 65.86,47.02 v65.86,46.95
CYBLE3  (via drill 0.3)
  Top 0.203: R8.1 105.89,75.66 106.87,74.69 145.56,74.69 147.46,72.79 147.46,10.71 139.22,2.48 91.6,2.48 89.97,4.11 89.97,9.44 86.79,12.62 R9.1 76.86,16.69 R21.2 66.04,16.8 v65.77,17.07 | v67.01,44.98 69.44,44.98 U2.12
  Bottom 0.203: v65.77,17.07 65.77,37.75 70.83,42.81 78.97,42.81 80.69,41.09 83.47,41.09 84.01,41.64 84.01,44.47 81.76,46.72 68.75,46.72 v67.01,44.98
CYBLE4  (via drill 0.3)
  Top 0.203: 69.47,50.16 U2.8 71.05,50.12 71.73,49.44 v71.73,45.83 | R23.2 64.57,27.22 64.57,25.67 v64.49,25.67
  Bottom 0.203: v64.49,25.67 59.81,25.67 58.45,27.03 58.45,38.96 59.93,40.43 67.27,40.43 70.83,44 79.04,44 81.3,41.74 82.82,41.74 83.38,42.3 83.38,43.99 81.49,45.88 71.78,45.88 v71.73,45.83
CYBLE5  (via drill 0.3)
  Top 0.203: R10.1 102.73,74.6 103.54,73.79 145.18,73.79 146.71,72.26 146.71,11.27 138.66,3.22 98.36,3.22 97.31,4.26 X3.4 97.31,10.59 95.48,12.42 92.05,12.42 89.84,14.63 84.83,14.63 79.96,19.5 v68.62,19.5 | v66.88,50.14 66.91,50.14 68.2,48.85 U2.9
  Bottom 0.203: v68.62,19.5 68.62,37.88 71.58,40.84 77.98,40.84 79.5,39.32 84.69,39.32 86.21,40.84 86.21,45.41 82.9,48.72 68.31,48.72 v66.88,50.14
DTR
  Top 0.203: R1.1 89.13,76.81 Q2.2 91.8,76.2 92.24,75.76 95.38,75.76 96.29,76.67 96.29,83.89 95.48,84.7 U1.13
DTR1
  Top 0.203: R25.1 39.54,73.96 Q9.2 40.02,74.02 40.62,74.62 40.62,78.42 40.1,78.94 32.36,78.94 30.93,77.51 30.93,67.64 32.3,66.28 50.71,66.28 52.51,68.08 52.51,85.78 51.9,86.39 50.25,86.39 U7.13
EN  (via drill 0.3)
  Top 0.203: C10.1 100.02,93.74 R4.1 97.81,93.78 S1.1 v93.44,91.69 | Q1.3 94.06,73.61 v95.33,73.61 | v72.11,56.45 69.53,56.45 U2.3
  Bottom 0.203: v95.33,73.61 96.28,74.56 96.28,82.99 93.44,85.83 v93.44,91.69 93.44,93.24 92.91,93.77 88.9,93.77 88.44,93.31 88.44,86.14 87.58,85.27 82.93,85.27 79.69,88.52 76.3,88.52 75.69,87.92 75.69,86.41 76.21,85.89 77.03,85.89 81.06,81.86 81.06,57.86 79.65,56.45 v72.11,56.45
EN1  (via drill 0.3)
  Top 0.203: C17.1 70.38,90.57 R27.1 66.35,90.57 v64.17,92.74 64.17,93.78 S3.1 | U9.3 31.71,56.23 30.23,57.71 30.23,78.65 31.21,79.64 42.18,79.64 42.76,79.06 v42.76,77.85 Q8.3
  Bottom 0.203: v42.76,77.85 32.99,77.85 32.15,78.69 32.15,90.16 32.79,90.81 48.2,90.81 50.57,88.43 63.02,88.43 64.17,89.58 64.17,92.76 v64.17,92.75 v64.17,92.74
GND  (via drill 0.3)
  Top 0.203: J2.S2 48.8,94.52 49.06,94.26 | 49.06,94.26 50.41,94.26 50.7,94.56 J2.5 | J1.S2 77.54,94.46 77.85,94.15 79.07,94.15 79.44,94.53 J1.5 79.44,88.99 78.91,88.46 78.44,88.46 U1.1 76.18,88.51 74.76,87.08 72.05,87.08 | C10.2 101.74,91.81 | 101.74,91.81 103.37,91.81 C11.2 | C17.2 72.42,92.5 C18.2 72.45,95.74 72.91,96.2 77.44,96.2 | 72.05,87.08 C3.2 72.02,84.78 C4.1 72.02,79.66 C5.1 v73.94,79.5 | 72.05,87.08 72.05,87.12 C1.2 | U7.1 44.69,90.17 | 44.69,90.17 43.48,90.17 41.41,88.1 39.66,88.1 | 39.66,88.1 C16.2 | 39.66,88.1 39.66,85.68 C12.1 C13.1 | 40.07,53.1 U9.39_10 U9.39_2 41.86,53.1 | 40.07,53.1 U9.39_1 39.98,58.15 39.36,58.77 | 41.86,53.1 U9.39_11 U9.39_3 U9.39_14 U9.39_6 43.57,51.27 | 41.86,53.1 41.82,53.06 U9.39_13 U9.39_5 | 40.07,53.1 39.98,53.02 U9.39_12 U9.39_4 | U9.39_4 U9.39_17 U9.39_7 | U9.39_4 U9.39_15 U9.39_5 | 41.87,51.27 U9.39_16 43.57,51.27 | 41.87,51.27 U9.39_5 | 43.57,51.27 43.57,50.44 U9.39_19 U9.39_9 U9.39_21 U9.39_8 | 41.87,51.27 41.82,51.22 U9.39_18 U9.39_8 | U9.39_7 U9.39_20 U9.39_8 | U2.39_2 U2.39_11 U2.39_3 | U2.39_2 U2.39_10 U2.39_1 U2.39_12 75.17,51.53 | U2.39_3 78.84,58.33 79.52,59.01 85.84,59.01 85.94,58.91 86.4,58.91 U2.38 | U2.39_3 U2.39_14 U2.39_6 78.8,51.51 | U2.39_2 U2.39_13 U2.39_5 | 75.17,51.53 U2.39_4 | 75.23,51.51 U2.39_15 76.92,51.51 | 75.23,51.51 75.19,51.51 75.17,51.53 | 76.92,51.51 U2.39_5 | U2.39_5 U2.39_16 78.8,51.51 | 78.8,51.51 78.8,50.63 U2.39_19 U2.39_9 U2.39_21 U2.39_8 77,49.69 | 76.92,51.51 76.92,50.67 U2.39_18 77,49.69 | 75.23,51.51 75.17,51.45 U2.39_17 U2.39_7 | U2.39_7 U2.39_20 76.1,49.69 77,49.69 | C19.2 C7.2 78.8,70.01 C8.2 75.75,70.12 C9.2 71.12,70.12 v71.09,70.15
  Top 0.203: U2.1 v66.87,59.01 62.63,59.01 | 62.63,59.01 61.83,59.81 U3.1 61.83,67.88 60.5,69.22 60.5,72.56 61.1,73.17 69.8,73.17 71.08,74.45 v71.05,74.49 | U8.1 52.76,63.64 51.3,62.18 51.3,58.8 | 51.3,58.8 U9.38 51.56,59.01 62.63,59.01 | 121.05,59.76 121.83,58.98 C21.2 130.24,58.03 U10.1 130.25,55.36 131.9,55.36 132.08,55.18 132.08,54.53 131.89,54.35 U10.3 130.21,54.32 129.68,54.32 129.66,54.33 127.32,54.33 126.95,53.97 126.95,52.22 126.65,51.92 | 121.05,59.76 MODUL-BATT1.IN- | MODUL-BATT1.IN- | EBYTEE220-900T22D1.GND 119.69,56.31 121.05,57.66 121.05,59.76 | 64.64,34.59 Q6.2 66.86,33.94 69.58,31.21 86.74,31.21 87.72,30.24 87.72,26.44 | 64.64,34.59 64.64,35.06 65.83,36.25 R16.1 | ADS1.ADDR 130.67,51.26 130.01,51.92 126.65,51.92 | 126.65,51.92 123.86,51.92 123.05,51.11 ADS1.GND | U4.2 110.76,14.81 | 110.76,14.81 112.94,14.81 113.25,15.12 113.25,19.94 112.22,20.96 109.22,20.96 108.36,21.82 Q4.2 | 39.36,58.77 U9.1 | 39.36,58.77 51.27,58.77 51.3,58.8 | U9.15 37.1,44.49 39.98,47.37 U9.39_7 | 101.74,91.81 101.74,95.15 101.2,95.7 91.72,95.7 90.94,94.91 90.94,91.94 90.49,91.5 84.87,91.5 83.94,92.42 J1.S1 84.04,96.2 | U2.39_7 75.17,47.28 72.29,44.4 U2.15 72.29,40.02 73.66,38.65 v75.46,38.65 | X4.3 52.65,4.87 54.01,3.5 74.1,3.5 74.97,4.38 X6.4 74.95,7.1 | U5.2 95.67,15.4 96.41,16.14 96.41,19.41 95.6,20.21 89.31,20.21 87.72,21.8 87.72,26.44 | 87.72,26.44 87.74,26.43 87.74,30.86 88.62,31.74 97.77,31.74 98.67,30.84 98.67,22.92 97.69,21.95 93.6,21.95 92.7,22.84 Q5.2 | 44.69,91.91 44.69,93.7 45.26,94.26 49.06,94.26 | 44.69,91.91 44.69,90.17 | 44.69,91.91 44.41,91.63 C20.2 C14.2 36.07,91.63 33.81,93.88 33.81,96.77 33.01,97.58 28.8,97.58 27.61,96.38 27.61,82.83 26.79,82.01 C15.- C2.- 12.3,82 C6.- 12.29,76.93 SUPER-STEPDOWN1.GND 10.46,75.04 SUPER-STEPDOWN1.IN- 10.46,21.81 7.89,24.37 4.16,24.37 2.2,26.33 2.2,40.03 2.24,40.07
  Top 0.203: MODUL-BATT1.BATT- 140.05,71.75 139.05,72.75 122.17,72.75 121.05,71.63 MODUL-BATT1.IN- | MODUL-BATT1.OUT- 123.17,88.76 124.47,90.06 124.47,97.72 123.37,98.82 98.62,98.82 97.73,97.92 93.76,97.92 | 93.76,97.92 S1.2 | S2.2 93.74,97.91 93.76,97.92 | D3.C 105.06,10.46 106.19,11.59 109.67,11.59 110.76,12.67 110.76,14.81 | X7.2 116.29,4.99 115.47,4.17 | 115.47,4.17 103.3,4.17 102.34,5.14 102.34,8.63 | 105.03,9.34 D3.C | 115.47,4.17 130.39,4.17 131.64,5.42 NEO-6MGPS1.GND | U6.2 68.17,25.38 66.62,23.83 44.43,23.83 43.61,24.65 43.61,28.68 44.39,29.46 49.19,29.46 | 48.87,29.45 49.21,29.45 49.19,29.46 | 102.34,8.63 102.34,11.09 101.83,11.59 99.43,11.59 95.62,15.4 U5.2 | D3.C 103.02,9.31 102.34,8.63 | 49.19,29.46 54.58,29.46 59.96,34.84 64.39,34.84 64.64,34.59 | U5.2 90.85,15.4 R21.1 | ADS2.GND 3,38.93 2.24,39.69 2.24,40.07 | 2.24,40.07 2.24,45.97 2.83,46.57 5.49,46.57 ADS2.ADDR
  Top 0.406: J1.S6 J1.S3 J1.S4 J1.S5 | J1.S6 77.44,96.2 J1.S2 | J1.S5 84.04,96.2 J1.S1 | J1.S5 87.76,98.55 S2.2 | J2.S2 48.7,96.21 J2.S6 J2.S3 J2.S4 J2.S5 | J2.S5 55.3,96.21 J2.S1 | J2.S5 59.06,98.56 | 59.06,98.56 S4.2 | 59.06,98.56 63.56,98.56 63.57,98.55 | 63.57,98.55 S3.2 | J1.S6 63.57,98.55 | X1.1 5.89,10.85 10.46,15.41 SUPER-STEPDOWN1.IN-
  Bottom 0.203: v73.94,79.5 74.38,79.07 74.38,75.37 73.49,74.49 v71.05,74.49 71.05,70.19 v71.09,70.15 | MODUL-BATT1.BATT- 135.57,70.26 134.5,71.33 134.5,85.65 131.36,88.78 121.07,88.78 MODUL-BATT1.OUT- | X6.4 73.73,8.32 73.73,18.39 75.62,20.28 88.22,20.28 89.45,19.05 R21.1 | R16.1 74.73,36.25 75.46,36.98 v75.46,38.65 | U2.39_10 70.65,53.35 69.4,54.6 69.4,58.12 68.47,59.05 66.9,59.05 v66.87,59.02 v66.87,59.01
IO0  (via drill 0.3)
  Top 0.203: R5.1 105.51,93.78 C11.1 103.39,93.79 103.39,95.65 102.51,96.52 89.55,96.52 88.41,95.39 S2.1 89.46,92.7 v89.46,92.44 | Q2.3 94,82.44 93.4,83.04 v90.11,83.04 | v88.88,42.51 U2.25
  Bottom 0.203: v90.11,83.04 89.53,83.04 89.46,83.04 | 89.46,83.04 v89.46,92.44 | v88.88,42.51 88.88,44.78 86.26,47.39 86.26,56.1 83.62,58.74 83.62,74.49 88.32,79.19 88.32,82.42 88.94,83.04 89.46,83.04
IO01  (via drill 0.3)
  Top 0.203: C18.1 72.51,90.47 | 72.51,90.47 R28.1 | 72.51,90.47 72.51,89.65 71.81,88.95 66.46,88.95 61.6,93.81 S4.1 v59.65,92.49 | Q9.3 38.47,76.15 v34.85,76.15 | U9.25 v51.33,40.03
  Bottom 0.203: v34.85,76.15 32.63,76.15 31.6,77.18 | 31.6,77.18 31.6,90.51 32.52,91.43 48.43,91.43 50.85,89.01 58.25,89.01 59.65,90.42 v59.65,92.49 | 31.6,77.18 31.6,42.9 35.2,39.29 50.59,39.29 v51.33,40.03
M0
  Top 0.203: EBYTEE220-900T22D1.M1 EBYTEE220-900T22D1.M0 99.27,53.21 97.49,51.43 90.19,51.43 87.62,48.85 U2.30
N$1
  Top 0.203: C4.2 67.09,82.2 66.12,83.17 66.12,86.64 64.86,87.89 Q3.2 61.05,87.89 60.1,86.94 60.1,75.35 61.25,74.2 68.35,74.2 70.69,76.54 78.83,76.54 79.92,77.64 79.92,80.33 79.36,80.89 U1.7
N$2
  Top 0.203: Q3.1 66.2,78.24 67.47,79.51 C5.2 70.17,78.14 70.96,77.35 77.61,77.35 78.38,78.12 U1.8
N$3
  Top 0.203: R1.2 91.73,74.56 Q1.1
N$4
  Top 0.203: R25.2 41.81,71.14 Q8.1
N$5  (via drill 0.3)
  Top 0.203: U1.4 73.39,84.7 v73.36,84.74 | v68.32,84.7 69.94,84.7 C3.1
  Bottom 0.203: v73.36,84.74 68.36,84.74 v68.32,84.7
N$6
  Top 0.203: R3.1 105.12,7.45 D3.A
N$7
  Top 0.203: SUPER-STEPDOWN1.+5V 4.79,75.63 D1.A
N$8
  Top 0.203: Q2.1 86.89,78.71 86.41,78.24 R2.2
N$9
  Top 0.203: R11.1 110.35,17.72 U4.1
N$10
  Top 0.203: R12.2 112.44,7.44 112.92,7.93 112.92,10.92 115.98,13.97 115.98,16.82 116.52,17.36 119.2,17.36 U4.4
N$11
  Top 0.203: U5.1 90.43,17.94 86.78,21.6 86.78,26.96 85.8,27.94 R13.1
N$12
  Top 0.203: Q4.3 107.41,25.14 | 107.41,25.14 107.41,27.96 K1.16 | D4.A 111.44,25.14 107.41,25.14
N$13  (via drill 0.3)
  Top 0.203: U4.3 121.14,14.81 122.02,15.69 122.02,20.28 121.28,21.02 117.84,21.02 v116.99,20.17 | v106.42,21.18 106.42,22.87 Q4.1
  Bottom 0.203: v116.99,20.17 107.44,20.17 v106.42,21.18
N$14
  Top 0.203: U5.4 103.99,17.94 R14.2
N$15
  Top 0.203: D5.A 96.42,24.44 96.42,28.2 95.54,29.09 K2.16 91.74,29.09 90.91,28.26 Q5.3
N$16
  Top 0.203: R26.2 38.54,68.33 37.59,69.28 Q9.1
N$17
  Top 0.203: Q5.1 89.97,21.72 90.66,21.02 96.49,21.02 97.38,20.14 97.38,16.27 98.24,15.4 U5.3
N$18
  Top 0.203: D9.A R17.1
N$19
  Top 0.203: R24.2 76.68,27.96 U6.4
N$20
  Top 0.203: D6.A 61.06,25.9 62.45,27.28 Q6.3
  Top 0.406: D6.A 50.46,27.33 K3.A2
N$21
  Top 0.203: D10.A 91.18,60 R18.1
N$22
  Top 0.203: D11.A 57.49,49.91 R19.1
N$23
  Top 0.203: D12.A 59.94,47.6 R20.1
N$24
  Top 0.203: Q6.1 64.68,32.01 67.67,32.01 74.27,25.41 U6.3
N$25
  Top 0.203: U6.1 66.95,29.17 R23.1
N$26  (via drill 0.3)
  Top 0.203: U7.4 43.29,86.36 v43.29,86.36 v43.28,86.36 | v36.24,88.12 37.57,88.12 C16.1
  Bottom 0.203: v43.28,86.36 41.27,86.36 39.52,88.12 v36.24,88.12
N$27
  Top 0.203: Q7.1 34.04,83.79 35.02,82.81 C13.2 37.72,81.89 38.32,81.29 U7.8
N$28
  Top 0.203: C12.2 35.16,85.62 34.09,86.69 34.09,92.34 33,93.43 Q7.2 29.62,93.43 28.68,92.48 28.68,81.13 29.63,80.17 45.97,80.17 46.53,80.73 46.53,81.94 45.91,82.56 U7.7
N$29
  Bottom 0.203: X7.1 118.83,4.98 120.03,3.78 143.61,3.78 148.88,9.05 148.88,77.2 146.83,79.26 MODUL-BATT1.BATT+
OUT1
  Top 0.203: SV1.1 52.93,34.62 61.97,43.66 61.97,55.75 60.2,57.51 51.33,57.51 U9.37
OUT2
  Top 0.203: SV1.2 50.39,35.63 54.1,39.34 54.1,42.7 53.27,43.54 U9.26
OUT3
  Top 0.203: SV1.3 47.27,33.74 U9.23
OUT4
  Top 0.203: SV1.4 45.31,37.42 44.05,38.68 39.19,38.68 38.38,39.49 U9.16
OUT5
  Top 0.203: SV1.5 42.77,36.58 41.45,37.9 29.7,37.9 28.67,38.93 28.67,41.37 29.58,42.28 34.3,42.28 U9.14
OUT6
  Top 0.203: SV1.6 40.23,36.17 39.11,37.29 29.09,37.29 27.91,38.46 27.91,42.46 29.02,43.56 34.29,43.56 U9.13
OUT7
  Top 0.203: SV1.7 37.69,35.68 36.77,36.6 28.33,36.6 27.26,37.66 27.26,43.4 28.7,44.84 34.28,44.84 U9.12
OUT8
  Top 0.203: SV1.8 35.15,35.05 34.29,35.9 27.62,35.9 26.59,36.93 26.59,47.08 28.16,48.65 34.28,48.65 U9.9
OUT9
  Top 0.203: SV1.9 32.61,34.46 31.9,35.17 27.27,35.17 25.95,36.5 25.95,48.82 27.01,49.89 U9.8
OUT+  (via drill 0.3)
  Top 0.203: MODUL-BATT1.IN+ 111.14,83.76 110.07,84.83 110.07,90.94 D8.C | 23.92,93.92 D2.C 13.39,93.92 12.29,92.81 C6.+ 6.29,86.39 4.79,84.89 D1.C 6.96,83.19 7.8,82.35 7.8,37.1 7.09,36.39 ADS2.VDD | 23.92,93.92 24.02,93.92 D7.C | U10.8 133.35,54.35 132.84,54.86 132.84,57.2 133.19,57.55 C21.1 133.09,59.07 v133.09,61.53 | C8.1 78.8,72.01 C7.1 81.41,72 | 81.41,72 C19.1 | R3.2 R12.1 111.22,11.3 114.73,14.81 114.73,20.71 116.7,22.67 116.7,23.93 | 116.7,23.93 D4.C 116.06,24.78 K1.1 116.06,29.16 | R14.1 105.32,15.85 105.76,16.29 105.76,19.58 104.69,20.65 101.6,20.65 100.81,21.43 D5.C | D5.C | K2.1 102.05,28.94 | 102.05,28.94 102.05,25.67 D5.C | NEO-6MGPS1.5V 139.26,23.02 | 139.26,23.02 138.07,24.21 116.98,24.21 116.7,23.93 | 111.94,56.28 111.94,52.44 114.64,49.73 119.57,49.73 120.51,48.8 ADS1.VDD 120.51,43.43 121.76,42.17 137.96,42.17 139.26,40.87 139.26,23.02 | 111.94,56.28 EBYTEE220-900T22D1.VCC | 116.06,29.16 116.06,30.47 114.72,31.82 102.7,31.82 102.01,31.12 102.01,28.98 102.05,28.94 | 116.16,29.06 116.06,29.16 | U3.3 v68.8,63.63 83.39,63.63 83.42,63.66 | 83.42,63.66 85,65.24 85,70.92 83.9,72.03 81.43,72.03 81.41,72 | U8.3 58.94,65.53 v59.57,66.15 | v24.06,95.3 24.06,94.05 23.92,93.92 | 83.42,63.66 110.64,63.66 111.94,62.37 111.94,56.28
  Top 0.406: R24.1 81.28,22.7 80.22,21.63 53.32,21.63 | K3.A1 52.32,15.33 52.39,15.4 52.84,15.4 | 52.84,15.4 53.88,16.44 53.88,21.07 53.32,21.63 | X6.1 59.73,14.17 58.51,15.4 52.84,15.4 | D6.C 53.32,21.63
  Bottom 0.203: v68.8,63.63 68.8,63.68 68.82,63.71 68.82,65.39 68.06,66.15 v59.57,66.15 59.57,85.42 61.6,87.45 63.86,87.45 65.46,89.06 65.46,92.87 64.8,93.53 58.68,93.53 57.88,92.73 57.88,90.52 57.03,89.67 50.93,89.67 48.67,91.94 26,91.94 24.06,93.88 v24.06,95.3 | MODUL-BATT1.IN+ 131.87,83.76 133.09,82.53 v133.09,61.53 113.34,61.53 111.97,60.15 EBYTEE220-900T22D1.VCC | K3.A1 45.87,15.62 39.39,22.1 10.49,22.1 5.46,27.12 5.46,36.35 ADS2.VDD
OUT-BATT
  Top 0.203: MODUL-BATT1.OUT+ 110.8,96.26 110.1,95.55 D8.A
PB-PWR
  Top 0.203: X3.3 92.23,9.96 R9.2 | R9.2
RTS
  Top 0.203: R2.1 86.41,73.17 86.99,72.59 Q1.2 91.79,72.11 92.3,71.6 95.78,71.6 96.86,72.68 96.86,84.41 95.28,85.98 83.89,85.98 U1.14
RTS1
  Top 0.203: R26.1 43.16,68.33 43.71,68.88 Q8.2 47.3,74.04 48.18,74.92 48.18,87.02 48.8,87.63 U7.14
RX  (via drill 0.3)
  Top 0.203: D10.C 91.18,55.59 90.8,55.2 U2.35 83.76,55.2 v83.73,55.18 | U1.3 v79.67,85.97 v79.68,85.98
  Bottom 0.203: v79.68,85.98 82.93,82.73 82.93,55.98 v83.73,55.18
RX1  (via drill 0.3)
  Top 0.203: D12.C 59.94,54.13 59.08,54.98 51.34,54.98 U9.35 49.03,54.96 v48.74,55.25 | U7.3 43.32,87.63 v43.08,87.87
  Bottom 0.203: v43.08,87.87 43.08,89.7 43.59,90.21 46.25,90.21 48.36,88.1 48.36,55.63 v48.74,55.25
RX_GPS  (via drill 0.3)
  Top 0.203: v53.63,49.9 53.61,49.88 U9.31
  Bottom 0.203: NEO-6MGPS1.RX 136.72,35.13 132,39.85 132,50.8 129.47,53.33 97.18,53.33 93.55,56.96 93.55,67.77 98.29,72.51 98.29,93.85 96.66,95.49 88.27,95.49 86.88,94.09 86.88,87.54 86.24,86.89 83.79,86.89 80.65,90.03 75.23,90.03 74.28,89.07 74.28,85.58 79,80.85 79,63.9 76.85,61.76 60.31,61.76 57.58,64.48 53.22,64.48 51.18,62.44 51.18,53.76 47.43,50.02 47.43,48.02 48.32,47.13 50.92,47.13 53.67,49.87 v53.63,49.9
RX_LORA
  Top 0.203: K1.P1 114.24,36.61 112.24,34.61 107.09,34.61 106.35,35.35 106.35,37.48 107.15,38.28 111.84,38.28 112.63,39.06 112.63,49.03 110.18,51.48 105.98,51.48 104.28,53.19 104.28,56.24 EBYTEE220-900T22D1.RXD
RX_MICRO  (via drill 0.3)
  Top 0.203: U9.27 53.72,44.8 v55.51,43.01 | v67.44,43.77 U2.13
  Bottom 0.203: v55.51,43.01 66.68,43.01 v67.44,43.77
RXLORA_CONFIG
  Bottom 0.203: K1.S1 116.06,45.82 122.63,39.25 122.63,18.9 104.91,1.19 48.99,1.19 47.57,2.6 X4.2
RXLORA_MICRO
  Top 0.203: K1.O1 118.14,41.69 118.86,40.98 118.86,34.98 117.76,33.88 106.74,33.88 105.71,34.9 105.71,37.78 107.44,39.51 110.68,39.51 111.88,40.7 111.88,48.65 109.91,50.62 93.13,50.62 88.77,46.26 86.55,46.26 U2.28
SCL  (via drill 0.3)
  Top 0.203: ADS1.SCL 125.59,45.09 127.34,43.33 144.56,43.33 145.87,44.64 145.87,53.96 144.48,55.35 U10.10 | U2.36 86.52,56.49 v88.25,56.49
  Bottom 0.203: v88.25,56.49 90.22,56.49 95.91,50.8 123.93,50.8 125.59,49.14 ADS1.SCL | v88.25,56.49 | v88.25,56.49 87.44,55.68 87.44,48.12 90.72,44.84 90.72,24.3 89.16,22.73 72.02,22.73 69.89,20.61 X6.3
SCL1  (via drill 0.3)
  Top 0.203: v53.22,56.25 53.2,56.23 U9.36
  Bottom 0.203: ADS2.SCL 29.09,41.47 32.98,37.58 52.32,37.58 53.56,38.82 53.56,47.02 56.55,50.01 56.55,55.45 55.74,56.25 v53.22,56.25
SDA  (via drill 0.3)
  Top 0.203: ADS1.SDA 128.13,45.5 129.02,44.6 144.16,44.6 145.03,45.48 145.03,53.85 144.04,54.85 U10.9 | U2.33 88.4,52.66 v88.43,52.63
  Bottom 0.203: ADS1.SDA 128.2,46.85 128.2,44.65 127.3,43.75 119.44,43.75 118.43,44.76 118.43,48.07 116.49,50.01 89.53,50.01 88.43,51.1 v88.43,52.63 88.43,52.58 88.41,52.56 88.41,48.08 91.49,45 91.49,23.81 89.61,21.94 74.63,21.94 72.5,19.81 72.5,4.69 71.53,3.71 65.65,3.71 64.81,4.55 X6.2
SDA1  (via drill 0.3)
  Top 0.203: v54.96,52.37 51.37,52.37 U9.33
  Bottom 0.203: ADS2.SDA 28.19,44.01 33.76,38.43 51.7,38.43 52.8,39.53 52.8,47.33 52.8,47.41 55.57,50.19 55.57,51.76 v54.96,52.37
TX  (via drill 0.3)
  Top 0.203: D9.C 93.52,54.31 93.14,53.93 U2.34 86.48,53.95 v82.67,53.95 | U1.2 76.72,87.24 v76.68,87.19
  Bottom 0.203: v76.68,87.19 76.98,87.19 82,82.17 82,54.62 v82.67,53.95
TX1  (via drill 0.3)
  Top 0.203: D11.C 57.47,53.1 56.87,53.7 U9.34 51.3,53.72 v48.72,53.72 | U7.2 45.91,88.9 v45.92,88.89
  Bottom 0.203: v45.92,88.89 47.43,87.38 47.43,55.01 v48.72,53.72 | v48.72,53.72
TX_GPS  (via drill 0.3)
  Top 0.203: v48.96,48.61 U9.30
  Bottom 0.203: NEO-6MGPS1.TX 134.18,35.19 129.39,39.97 129.39,50.1 127.44,52.05 96.59,52.05 92.29,56.35 92.29,68.18 97.22,73.11 97.22,92.08 94.66,94.65 88.72,94.65 87.67,93.6 87.67,86.89 86.84,86.06 83.33,86.06 80.13,89.25 76,89.25 75,88.25 75,85.91 79.74,81.17 79.74,63.46 77.2,60.91 59.97,60.91 57.21,63.67 53.12,63.67 51.98,62.52 51.98,51.58 49,48.61 v48.96,48.61
TX_LORA
  Top 0.203: K1.P2 112.02,36.61 113.28,37.88 113.28,49.54 110.47,52.36 108,52.36 106.89,53.47 EBYTEE220-900T22D1.TXD
TX_MICRO  (via drill 0.3)
  Top 0.203: U9.28 54.43,46.07 v54.45,46.05 | U2.23 82.4,41.55 v82.4,43.36
  Bottom 0.203: v54.45,46.05 54.45,41.89 55.09,41.25 66.72,41.25 70.31,44.84 80.91,44.84 v82.4,43.36
TXLORA_CONFIG
  Bottom 0.203: K1.S2 110.96,44.26 116.72,44.26 121.74,39.23 121.74,19.53 104.01,1.79 52.32,1.79 50.24,3.88 50.24,9.3 49.26,10.28 43.16,10.28 42.49,9.61 X4.1
TXLORA_MICRO
  Top 0.203: K1.O2 109.97,41.69 111.06,42.79 111.06,48.27 109.51,49.82 93.35,49.82 88.57,45.04 U2.27
USB1_N
  Top 0.203: J2.2 52.65,94.18 51.21,92.75 48.41,92.75 47.48,91.81 47.48,85.65 45.65,83.82 U7.6
USB1_P
  Top 0.203: J2.3 52,94.18 50.92,93.1 48.27,93.1 47.12,91.96 47.12,85.8 46.42,85.1 U7.5
USB_N
  Top 0.203: J1.2 81.39,84.23 79.32,82.16 U1.6
USB_P
  Top 0.203: J1.3 80.74,84.09 80.08,83.43 U1.5
VALVE  (via drill 0.3)
  Top 0.203: U2.37 88.69,57.74 v88.96,58.01 | v83.74,23.96 83.74,25.98 R13.2
  Bottom 0.203: v88.96,58.01 88.76,57.81 88.28,57.81 86.89,56.41 86.89,47.79 90.02,44.66 90.02,25.07 88.49,23.55 84.17,23.55 83.75,23.97 v83.74,23.96
VALVE1
  Bottom 0.203: K2.S1 104.43,46.87 105.34,45.96 105.34,34.88 106.49,33.73 119.75,33.73 120.87,32.61 120.87,19.92 103.32,2.37 56.46,2.37 55.02,3.81 55.02,9.96 53.68,11.3 36.8,11.3 35.35,9.85 X5.2
VALVE2
  Bottom 0.203: K2.P1 102.05,36.03 105.59,32.49 118.79,32.49 120.03,31.24 120.03,20.32 102.77,3.06 58.55,3.06 56.98,4.63 56.98,10.82 55.51,12.29 31.61,12.29 30.27,10.95 X5.1
VCC
  Top 0.203: R4.2 97.85,90.02 99.06,88.81 104.84,88.81 105.56,89.52 | 105.56,89.52 R5.2 | 69.49,57.76 U2.2 71.83,57.74 72.49,58.4 72.49,59.84 71.67,60.65 71.54,60.65 | R17.2 93.5,61.91 R18.2 77.7,61.91 76.42,60.64 71.55,60.64 71.54,60.65 | 71.54,60.65 64.86,60.65 64.12,61.4 U3.2 U3.4 65.92,72.12 C9.1 72.62,73.35 73.41,74.15 83.77,74.15 87.64,70.28 96.26,70.28 98.26,72.27 98.26,78.66 99.4,79.8 R10.2 102.74,79.81 R8.2 | 105.56,89.52 105.56,80.15 R8.2 | R7.2 | R6.2 R7.2 | R7.2 R8.2
VCC1  (via drill 0.3)
  Top 0.203: U8.2 56.65,63.79 | 56.65,63.79 56.65,64.64 | 56.65,64.64 U8.4 56.65,94.15 58.27,95.78 65.33,95.78 66.92,94.19 v68.27,94.19 68.27,92.48 R27.2 | R19.2 R20.2 59.96,44.18 v59.98,44.16 | U9.2 32.44,57.5 31.39,58.55 31.39,64.78 31.86,65.26 56.04,65.26 56.65,64.64 | v40.39,95.28 40.45,95.22 C20.1 | v74.75,93.73 74.78,93.7 R28.2 | v56.66,62.04 56.66,63.79 56.65,63.79
  Bottom 0.203: v40.39,95.28 44.34,95.28 45.61,94.01 68.09,94.01 v68.27,94.19 74.3,94.19 v74.75,93.73 | v59.98,44.16 59.98,58.71 v56.66,62.04
VUSB  (via drill 0.3)
  Top 0.203: J1.1 82.04,89.11 82.64,88.51 U1.16 85.71,88.51 v85.72,88.52 | C2.+ 18.06,86.48 D2.A 19.45,90.56 21.11,92.21 25.28,92.21 25.88,92.81 25.88,95.89 v25.82,95.95 | C1.1 68.53,87.16 v68.52,87.17
  Bottom 0.203: v85.72,88.52 85.72,89.39 83.78,91.33 77.32,91.33 | 77.32,91.33 77.32,93.76 75.76,95.33 45.45,95.33 44.4,96.38 26.25,96.38 v25.82,95.95 | v68.52,87.17 68.52,90.61 69.25,91.35 77.3,91.35 77.32,91.33
VUSB1  (via drill 0.3)
  Top 0.203: J2.1 53.3,94.2 52.13,93.03 | U7.16 50.22,91.12 52.13,93.03 | C15.+ 24.04,86.61 D7.A 25.95,90.53 26.92,91.51 26.92,96.83 28.4,98.31 35.92,98.31 37.8,96.42 37.8,95.95 | 37.8,95.95 C14.1 | v53.48,92.72 52.44,92.72 52.13,93.03 | v42.48,93.51 42.48,95.8 42.01,96.27 38.13,96.27 37.8,95.95
  Bottom 0.203: v42.48,93.51 43.26,92.72 v53.48,92.72 53.5,92.74